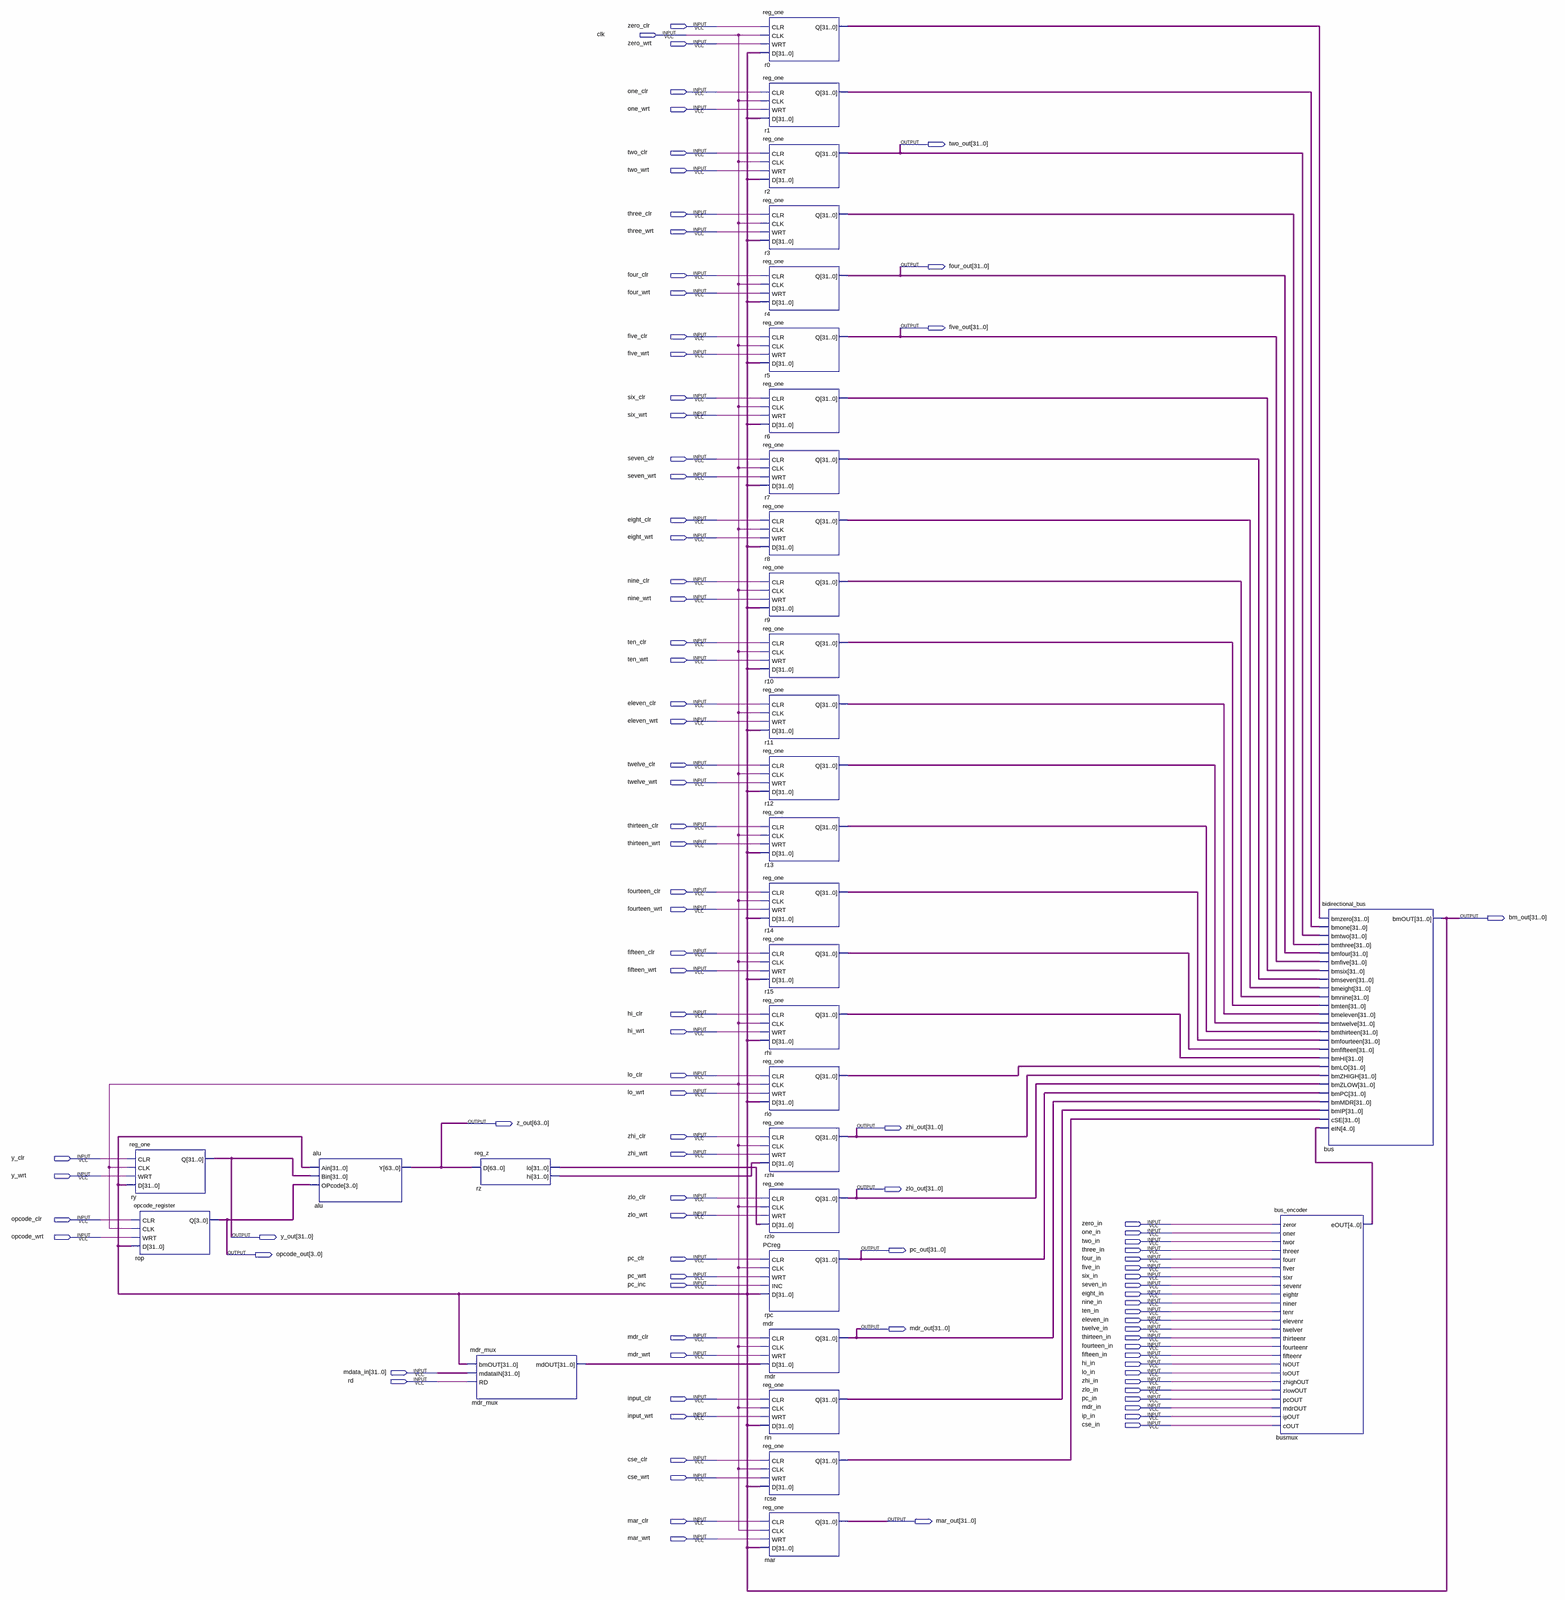
[diagram p0: schematic sheet, whole]
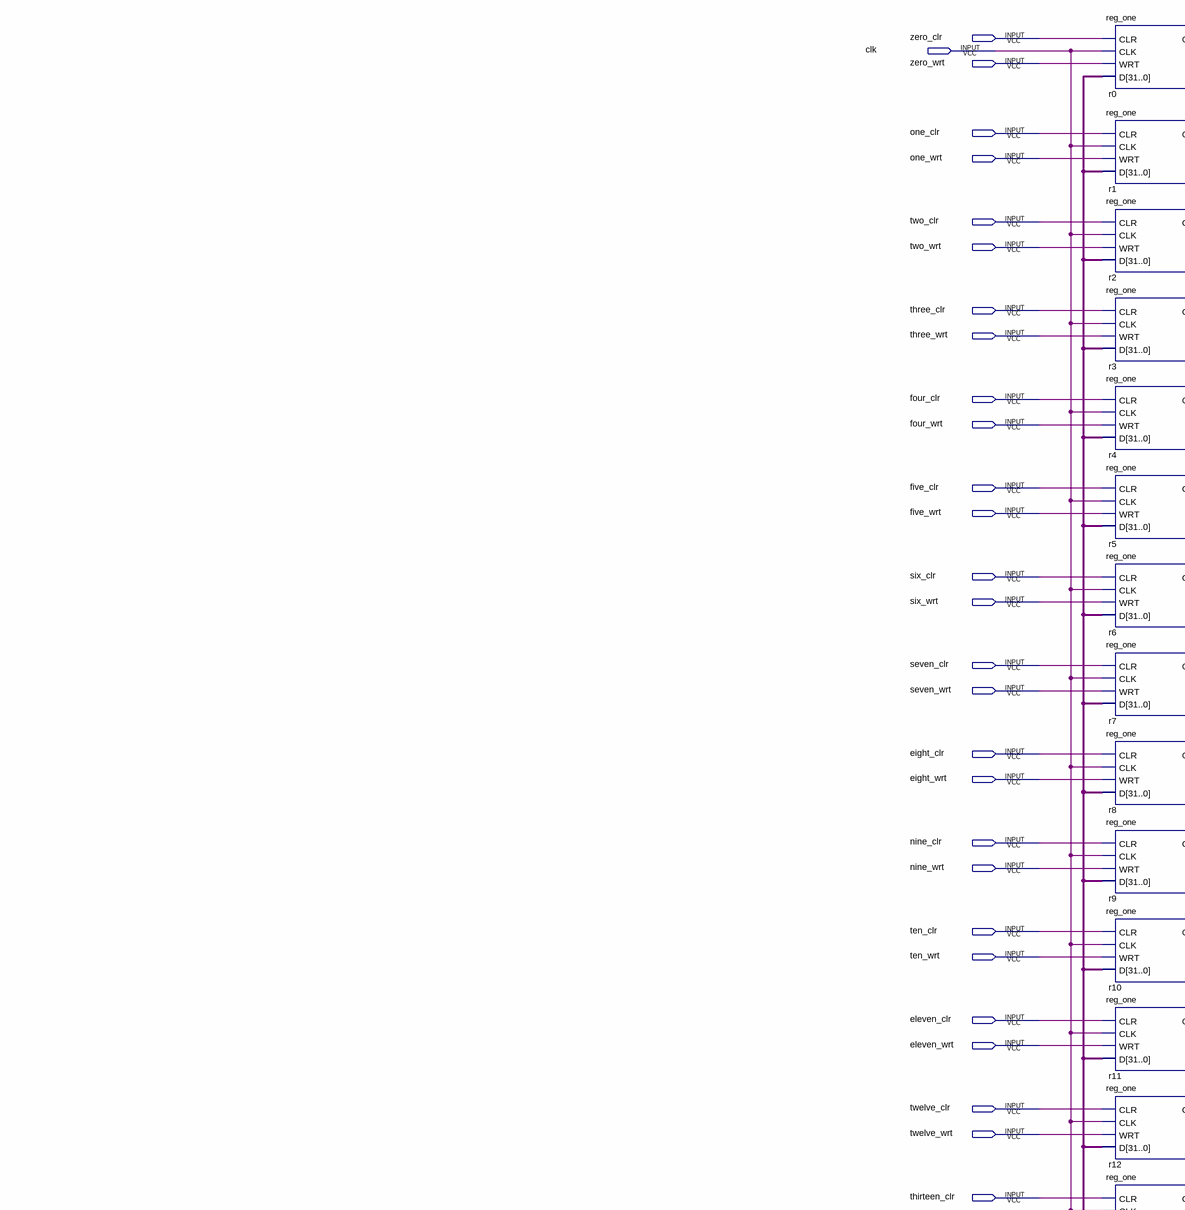
[diagram p1: schematic sheet, upper left part]
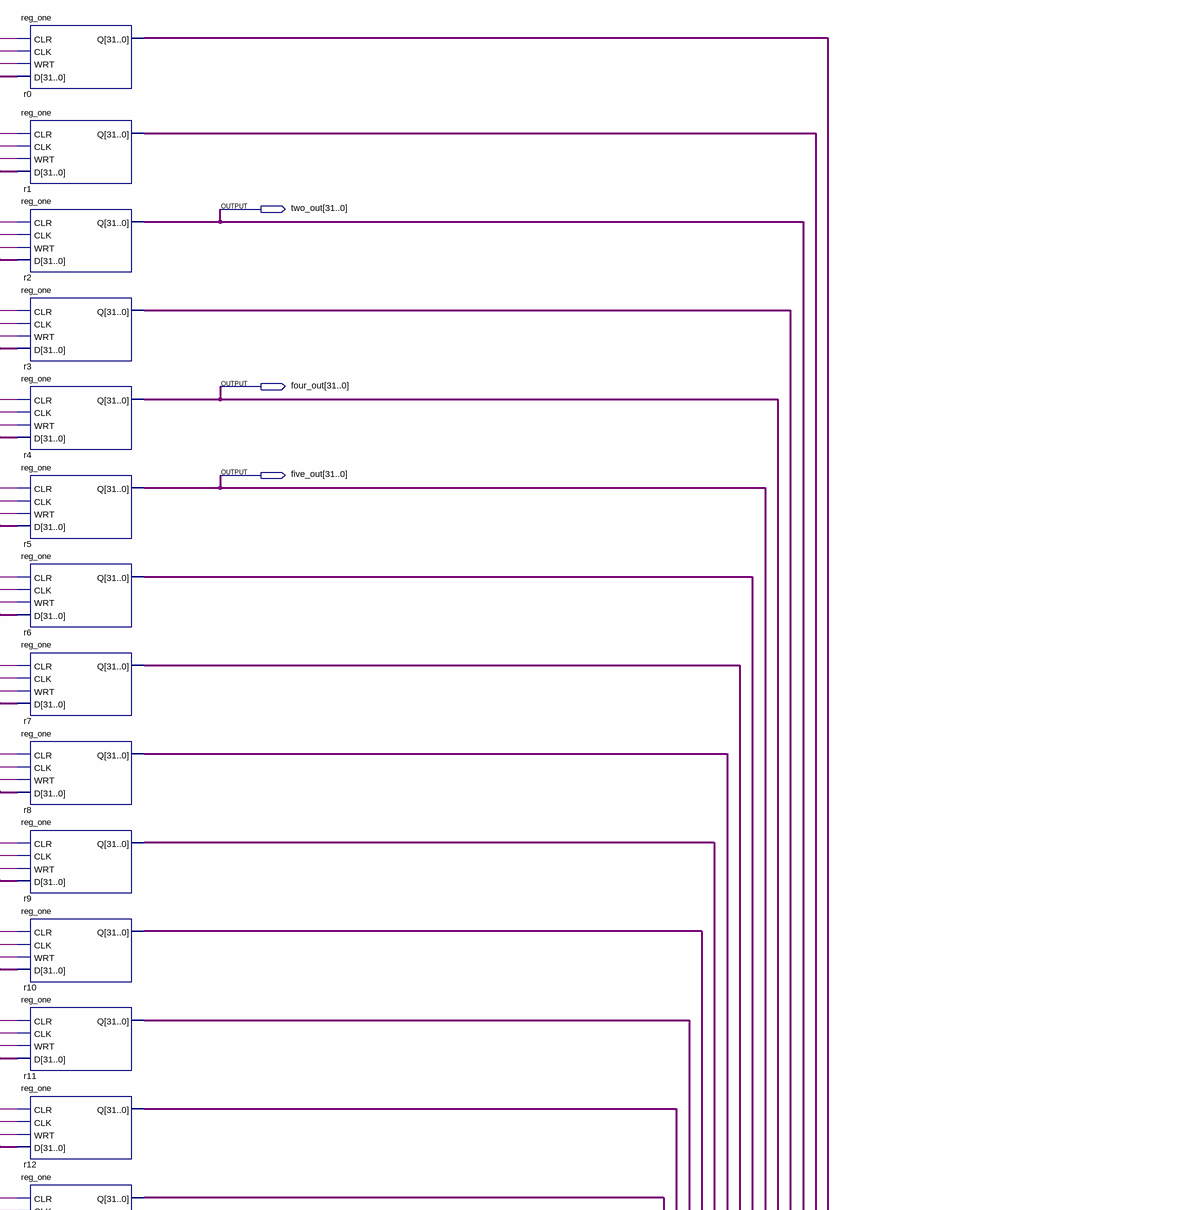
[diagram p2: schematic sheet, upper right part]
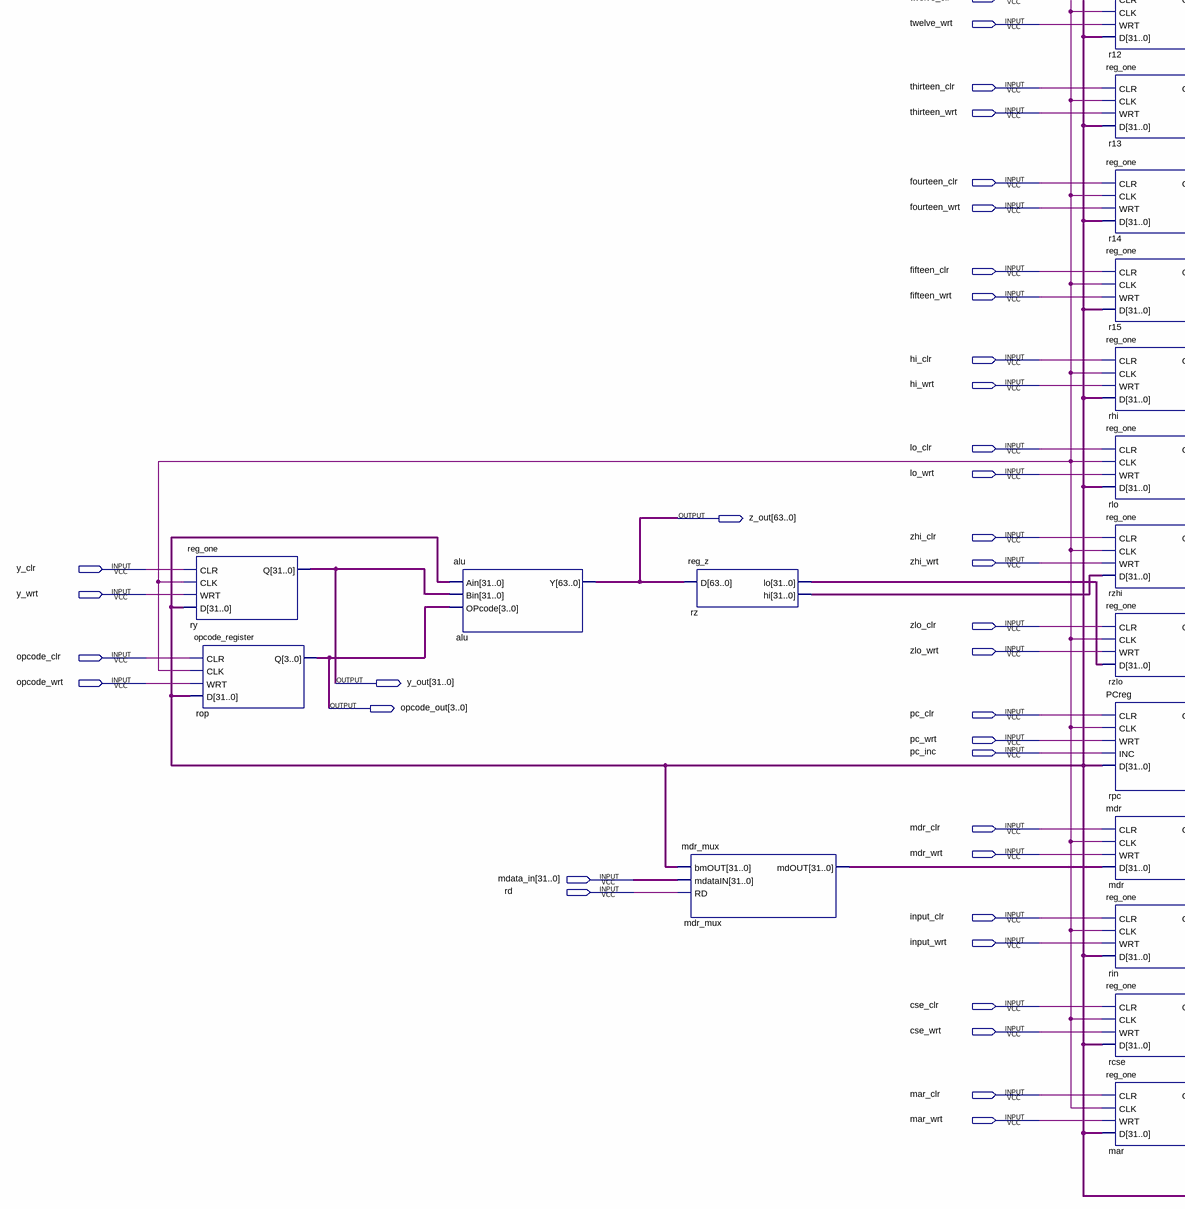
[diagram p3: schematic sheet, lower left part]
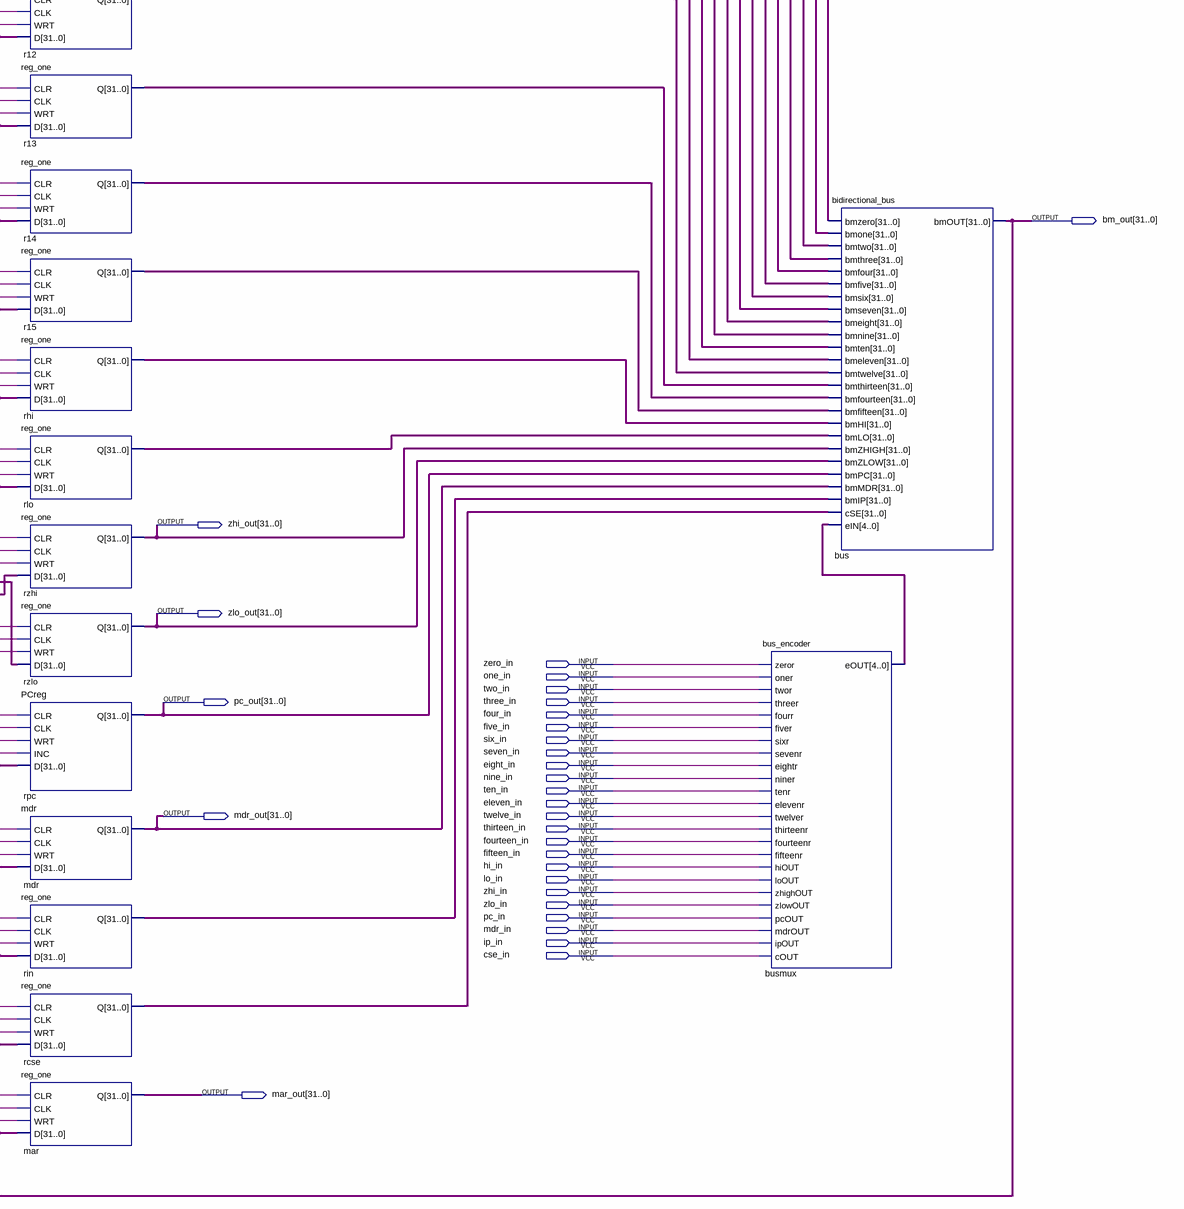
[diagram p4: schematic sheet, lower right part]
// Quartus schematic proc.bdf as structural Verilog: 32 symbols, 94 pins
module proc (
  input  zero_clr,
  input  clk,
  input  zero_wrt,
  input  one_clr,
  input  one_wrt,
  input  two_clr,
  input  two_wrt,
  input  three_clr,
  input  three_wrt,
  input  four_clr,
  input  four_wrt,
  input  five_clr,
  input  five_wrt,
  input  six_clr,
  input  six_wrt,
  input  seven_clr,
  input  seven_wrt,
  input  eight_clr,
  input  eight_wrt,
  input  nine_clr,
  input  nine_wrt,
  input  ten_clr,
  input  ten_wrt,
  input  eleven_clr,
  input  eleven_wrt,
  input  twelve_clr,
  input  twelve_wrt,
  input  thirteen_clr,
  input  thirteen_wrt,
  input  fourteen_clr,
  input  fourteen_wrt,
  input  fifteen_clr,
  input  fifteen_wrt,
  input  hi_clr,
  input  hi_wrt,
  input  lo_clr,
  input  lo_wrt,
  input  zhi_clr,
  input  zhi_wrt,
  input  y_clr,
  input  y_wrt,
  input  zlo_clr,
  input  zlo_wrt,
  input  opcode_clr,
  input  zero_in,
  input  one_in,
  input  opcode_wrt,
  input  two_in,
  input  three_in,
  input  pc_clr,
  input  four_in,
  input  five_in,
  input  pc_wrt,
  input  six_in,
  input  pc_inc,
  input  seven_in,
  input  eight_in,
  input  nine_in,
  input  ten_in,
  input  eleven_in,
  input  twelve_in,
  input  mdr_clr,
  input  thirteen_in,
  input  fourteen_in,
  input  mdr_wrt,
  input  fifteen_in,
  input  hi_in,
  input  [31:0] mdata_in,
  input  lo_in,
  input  rd,
  input  zhi_in,
  input  zlo_in,
  input  input_clr,
  input  pc_in,
  input  mdr_in,
  input  input_wrt,
  input  ip_in,
  input  cse_in,
  input  cse_clr,
  input  cse_wrt,
  input  mar_clr,
  input  mar_wrt,
  output [31:0] two_out,
  output [31:0] four_out,
  output [31:0] five_out,
  output [31:0] bm_out,
  output [63:0] z_out,
  output [31:0] zhi_out,
  output [31:0] zlo_out,
  output [31:0] y_out,
  output [31:0] pc_out,
  output [3:0] opcode_out,
  output [31:0] mdr_out,
  output [31:0] mar_out
);

  wire [4:0] busmux_eout;
  wire [31:0] mdr_mux_mdout, r0_q, r1_q, r3_q, r6_q, r7_q, r8_q, r9_q, r10_q, r11_q, r12_q, r13_q, r14_q,
       r15_q, rcse_q, rhi_q, rin_q, rlo_q, rz_hi, rz_lo;

  reg_one ry (.CLR(y_clr), .CLK(clk), .WRT(y_wrt), .D(bm_out), .Q(y_out));
  opcode_register rop (.CLR(opcode_clr), .CLK(clk), .WRT(opcode_wrt), .D(bm_out), .Q(opcode_out));
  alu alu (.Ain(bm_out), .Bin(y_out), .OPcode(opcode_out), .Y(z_out));
  reg_z rz (.D(z_out), .lo(rz_lo), .hi(rz_hi));
  mdr_mux mdr_mux (.bmOUT(bm_out), .mdataIN(mdata_in), .RD(rd), .mdOUT(mdr_mux_mdout));
  reg_one r0 (.CLR(zero_clr), .CLK(clk), .WRT(zero_wrt), .D(bm_out), .Q(r0_q));
  reg_one r1 (.CLR(one_clr), .CLK(clk), .WRT(one_wrt), .D(bm_out), .Q(r1_q));
  reg_one r2 (.CLR(two_clr), .CLK(clk), .WRT(two_wrt), .D(bm_out), .Q(two_out));
  reg_one r3 (.CLR(three_clr), .CLK(clk), .WRT(three_wrt), .D(bm_out), .Q(r3_q));
  reg_one r4 (.CLR(four_clr), .CLK(clk), .WRT(four_wrt), .D(bm_out), .Q(four_out));
  reg_one r5 (.CLR(five_clr), .CLK(clk), .WRT(five_wrt), .D(bm_out), .Q(five_out));
  reg_one r6 (.CLR(six_clr), .CLK(clk), .WRT(six_wrt), .D(bm_out), .Q(r6_q));
  reg_one r7 (.CLR(seven_clr), .CLK(clk), .WRT(seven_wrt), .D(bm_out), .Q(r7_q));
  reg_one r8 (.CLR(eight_clr), .CLK(clk), .WRT(eight_wrt), .D(bm_out), .Q(r8_q));
  reg_one r9 (.CLR(nine_clr), .CLK(clk), .WRT(nine_wrt), .D(bm_out), .Q(r9_q));
  reg_one r10 (.CLR(ten_clr), .CLK(clk), .WRT(ten_wrt), .D(bm_out), .Q(r10_q));
  reg_one r11 (.CLR(eleven_clr), .CLK(clk), .WRT(eleven_wrt), .D(bm_out), .Q(r11_q));
  reg_one r12 (.CLR(twelve_clr), .CLK(clk), .WRT(twelve_wrt), .D(bm_out), .Q(r12_q));
  reg_one r13 (.CLR(thirteen_clr), .CLK(clk), .WRT(thirteen_wrt), .D(bm_out), .Q(r13_q));
  reg_one r14 (.CLR(fourteen_clr), .CLK(clk), .WRT(fourteen_wrt), .D(bm_out), .Q(r14_q));
  reg_one r15 (.CLR(fifteen_clr), .CLK(clk), .WRT(fifteen_wrt), .D(bm_out), .Q(r15_q));
  reg_one rhi (.CLR(hi_clr), .CLK(clk), .WRT(hi_wrt), .D(bm_out), .Q(rhi_q));
  reg_one rlo (.CLR(lo_clr), .CLK(clk), .WRT(lo_wrt), .D(bm_out), .Q(rlo_q));
  reg_one rzhi (.CLR(zhi_clr), .CLK(clk), .WRT(zhi_wrt), .D(rz_hi), .Q(zhi_out));
  reg_one rzlo (.CLR(zlo_clr), .CLK(clk), .WRT(zlo_wrt), .D(rz_lo), .Q(zlo_out));
  PCreg rpc (.CLR(pc_clr), .CLK(clk), .WRT(pc_wrt), .INC(pc_inc), .D(bm_out), .Q(pc_out));
  mdr mdr (.CLR(mdr_clr), .CLK(clk), .WRT(mdr_wrt), .D(mdr_mux_mdout), .Q(mdr_out));
  reg_one rin (.CLR(input_clr), .CLK(clk), .WRT(input_wrt), .D(bm_out), .Q(rin_q));
  reg_one rcse (.CLR(cse_clr), .CLK(clk), .WRT(cse_wrt), .D(bm_out), .Q(rcse_q));
  reg_one mar (.CLR(mar_clr), .CLK(clk), .WRT(mar_wrt), .D(bm_out), .Q(mar_out));
  bus_encoder busmux (
    .zeror(zero_in), .oner(one_in), .twor(two_in), .threer(three_in), .fourr(four_in), .fiver(five_in),
    .sixr(six_in), .sevenr(seven_in), .eightr(eight_in), .niner(nine_in), .tenr(ten_in), .elevenr(eleven_in),
    .twelver(twelve_in), .thirteenr(thirteen_in), .fourteenr(fourteen_in), .fifteenr(fifteen_in),
    .hiOUT(hi_in), .loOUT(lo_in), .zhighOUT(zhi_in), .zlowOUT(zlo_in), .pcOUT(pc_in), .mdrOUT(mdr_in),
    .ipOUT(ip_in), .cOUT(cse_in), .eOUT(busmux_eout));
  bidirectional_bus bus (
    .bmzero(r0_q), .bmone(r1_q), .bmtwo(two_out), .bmthree(r3_q), .bmfour(four_out), .bmfive(five_out),
    .bmsix(r6_q), .bmseven(r7_q), .bmeight(r8_q), .bmnine(r9_q), .bmten(r10_q), .bmeleven(r11_q),
    .bmtwelve(r12_q), .bmthirteen(r13_q), .bmfourteen(r14_q), .bmfifteen(r15_q), .bmHI(rhi_q), .bmLO(rlo_q),
    .bmZHIGH(zhi_out), .bmZLOW(zlo_out), .bmPC(pc_out), .bmMDR(mdr_out), .bmIP(rin_q), .cSE(rcse_q),
    .eIN(busmux_eout), .bmOUT(bm_out));
endmodule
